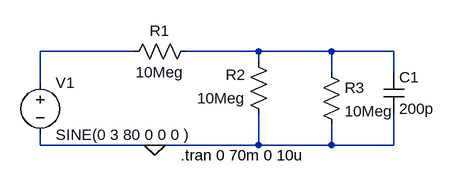
[diagram p0: schematic Exp2part9.asc]
Exp2part9.asc, the LTspice schematic file:
Version 4
SHEET 1 880 680
WIRE 32 80 -112 80
WIRE 224 80 112 80
WIRE 336 80 224 80
WIRE 432 80 336 80
WIRE 224 96 224 80
WIRE 336 112 336 80
WIRE 432 112 432 80
WIRE -112 128 -112 80
WIRE -112 224 -112 208
WIRE 64 224 -112 224
WIRE 224 224 224 176
WIRE 224 224 64 224
WIRE 336 224 336 192
WIRE 336 224 224 224
WIRE 432 224 432 176
WIRE 432 224 336 224
FLAG 64 224 0
SYMBOL voltage -112 112 R0
WINDOW 123 0 0 Left 0
WINDOW 39 0 0 Left 0
SYMATTR InstName V1
SYMATTR Value SINE(0 3 80 0 0 0 )
SYMBOL res 128 64 R90
WINDOW 0 0 56 VBottom 2
WINDOW 3 32 56 VTop 2
SYMATTR InstName R1
SYMATTR Value 10Meg
SYMBOL res 240 192 R180
WINDOW 0 36 76 Left 2
WINDOW 3 36 40 Left 2
SYMATTR InstName R2
SYMATTR Value 10Meg
SYMBOL res 320 96 R0
SYMATTR InstName R3
SYMATTR Value 10Meg
SYMBOL cap 416 112 R0
SYMATTR InstName C1
SYMATTR Value 200p
TEXT 104 240 Left 2 !.tran 0 70m 0 10u

The netlist it stands for:
* Exp2part9.asc
V1 N001 0 SINE(0 3 80 0 0 0 )
R1 N002 N001 10Meg
R2 0 N002 10Meg
R3 N002 0 10Meg
C1 N002 0 200p
.tran 0 70m 0 10u
.backanno
.end